# Altium project USB to Serial Programmer.PrjPCB
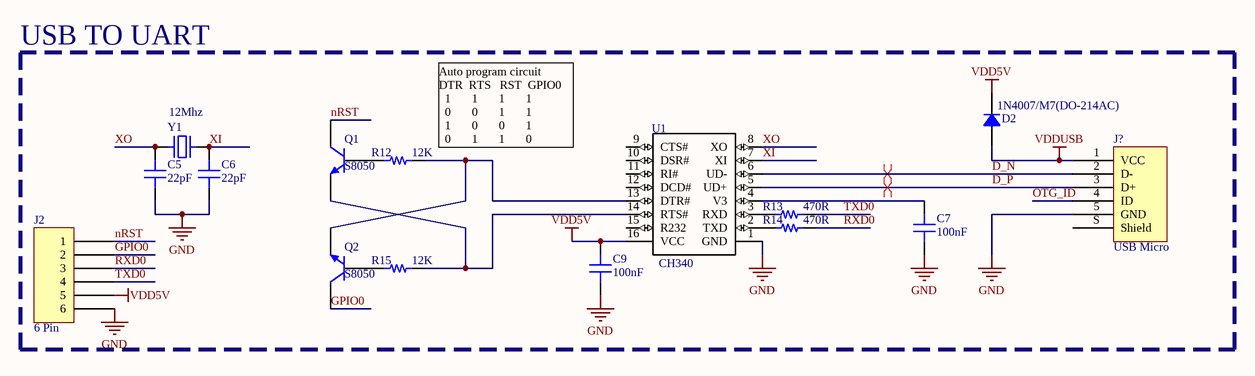
[diagram p0: USB to Serial Programmer.SchDoc]
1 sheet, 15 parts. Net scope: global (net labels, ports and power ports of the same name join across sheets).
Board file: USB to Serial Programmer.PcbDoc

## Sheet USB to Serial Programmer.SchDoc
size A3

### Parts
C5  22pF  [CAP 1206/3216]
C6  22pF  [CAP 1206/3216]
C7  100nF  [CAP 1206/3216]
C9  100nF  [CAP 1206/3216]
D2  1N4007/M7(DO-214AC)  [DO214AC SMA]
J2  6 Pin  [HDR 1X6]
J?  USB Micro  [FCI USB 10118193-0001LF]
Q1  S8050  [SOT23]
Q2  S8050  [SOT23]
R12  12K  [RES 1206/3216]
R13  470R  [RES 1206/3216]
R14  470R  [RES 1206/3216]
R15  12K  [RES 1206/3216]
U1  CH340  [SO16]
Y1  12Mhz  [xtal]

### Blocks framed on the sheet
USB TO UART: C5-C7 C9 D2 J2 J? Q1 Q2 R12-R15 U1 Y1

### Nets
GND: C5.1 C6.1 C7.1 C9.1 J2.6 J?.5(GND) U1.1(GND)
VDD5V: C9.2 D2.2 J2.5 U1.16(VCC)
VDDUSB: D2.1 J?.1(VCC)
D_N: J?.2(D-) U1.6(UD-)
D_P: J?.3(D+) U1.5(UD+)
GPIO0: J2.2 Q2.C
nRST: J2.1 Q1.C
OTG_ID: J?.4(ID)
RXD0: J2.3 R14.2
TXD0: J2.4 R13.2
XI: C6.2 U1.7(XI) Y1.2
XO: C5.2 U1.8(XO) Y1.1
NetC7_2: C7.2 U1.4(V3)
NetQ1_B: Q1.B R12.1
NetQ1_E: Q1.E R15.2 U1.14(RTS#)
NetQ2_B: Q2.B R15.1
NetQ2_E: Q2.E R12.2 U1.13(DTR#)
NetR13_1: R13.1 U1.3(RXD)
NetR14_1: R14.1 U1.2(TXD)

Not connected (* = marked no-connect by the designer): J? S(Shield); U1 9(CTS#) 10(DSR#) 11(RI#) 12(DCD#) 15(R232)

### Layout directives
differential pair: D_N, D_P

### Notes on the sheet
- (near R12) Auto program circuit
  DTR  RTS   RST  GPIO0
  1       1       1       1
  0       0       1       1
  1       0       0       1
  0       1       1       0

### Library data of the parts
C5-C7 C9 = Capacitor: SMT Capacitor; Value: 0.1uF
D2 = Diode: Rectifier Diode
J? = USB 2.0 Type B Micro
Q1 Q2 = 2N2222: NPN; E-mail: picpars@gmail.com; De: Seyed Mohsen Ghasemian; web: www.picpars.com
R12-R15 = Resistor: SMT Resistor; Value: 1K
U1 = CH340: MF: Eaton / Cutler Hammer; Package: None; MP: CH340; Price: 223.47 USD; Availability: Bad; Value: *
Y1 = xtal: SMT Crystal